# EAGLE design RPi GPS (EAGLE 7.7.0)
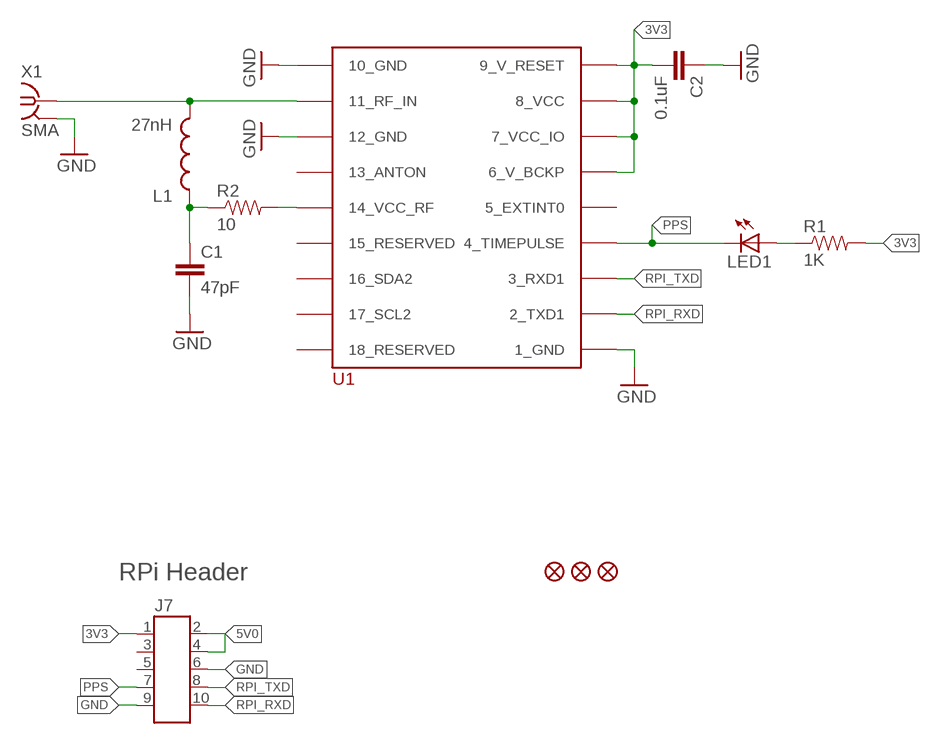
[diagram p0: schematic, sheet 1]

## Parts
C1  47pF  CAP0603-CAP  [0603-CAP]
C2  0.1uF  CAP0603-CAP  [0603-CAP]
FID2  FIDUCIAL  [FIDUCIAL]
FID3  FIDUCIAL  [FIDUCIAL]
FID4  FIDUCIAL  [FIDUCIAL]
J7  HEADER-2X5-0.1  [HEADER-2X5]
L1  27nH  INDUCTOR0603  [0603]
LED1  LED0603  [LED-0603]
R1  1K  RESISTOR0603-RES  [0603-RES]
R2  10  RESISTOR0603-RES  [0603-RES]
U1  UBLOX_MAX  [UBLOX_MAX]
X1  SMA  [SMA_EDGE]

## Nets
3V3: C2.2 J7.1 R1.2 U1.6_V_BCKP U1.7_VCC_IO U1.8_VCC U1.9_V_RESET
5V0: J7.2 J7.4
GND: C1.2 C2.1 J7.6 J7.9 U1.1_GND U1.10_GND U1.12_GND X1.GND@1 X1.GND@2 X1.GND@3 X1.GND@4
N$1: L1.2 U1.11_RF_IN X1.SIG
N$2: LED1.A R1.1
N$3: R2.2 U1.14_VCC_RF
N$4: C1.1 L1.1 R2.1
PPS: J7.7 LED1.C U1.4_TIMEPULSE
RPI_RXD: J7.10 U1.2_TXD1
RPI_TXD: J7.8 U1.3_RXD1
Unconnected: J7.3 J7.5 U1.5_EXTINT0 U1.13_ANTON U1.15_RESERVED U1.16_SDA2 U1.17_SCL2 U1.18_RESERVED

## Notes on the sheet
- RPi Header

## Library data of the parts
C1 C2 = SparkFun:CAP: Capacitor Standard 0603 ceramic capacitor, and 0.1" leaded capacitor.
FID2-FID4 = Nigel:FIDUCIAL
J7 = Nigel:HEADER-2X5
L1 = SparkFun:INDUCTOR: Inductors Basic Inductor/Choke - 0603 and 1206. Footprints are not proven and vary greatly between part numbers.
LED1 = SparkFun:LED: LEDs Standard schematic elements and footprints for 5mm, 3mm, 1206, and 0603 sized LEDs. 5mm - Spark Fun Electronics SKU : COM-00529 (and others)
R1 R2 = SparkFun:RESISTOR: Resistor Basic schematic elements and footprints for 0603, 1206, and PTH resistors.
U1 = Ava:UBLOX_MAX: UBLOX MAX
X1 = Nigel:SMA

## Board
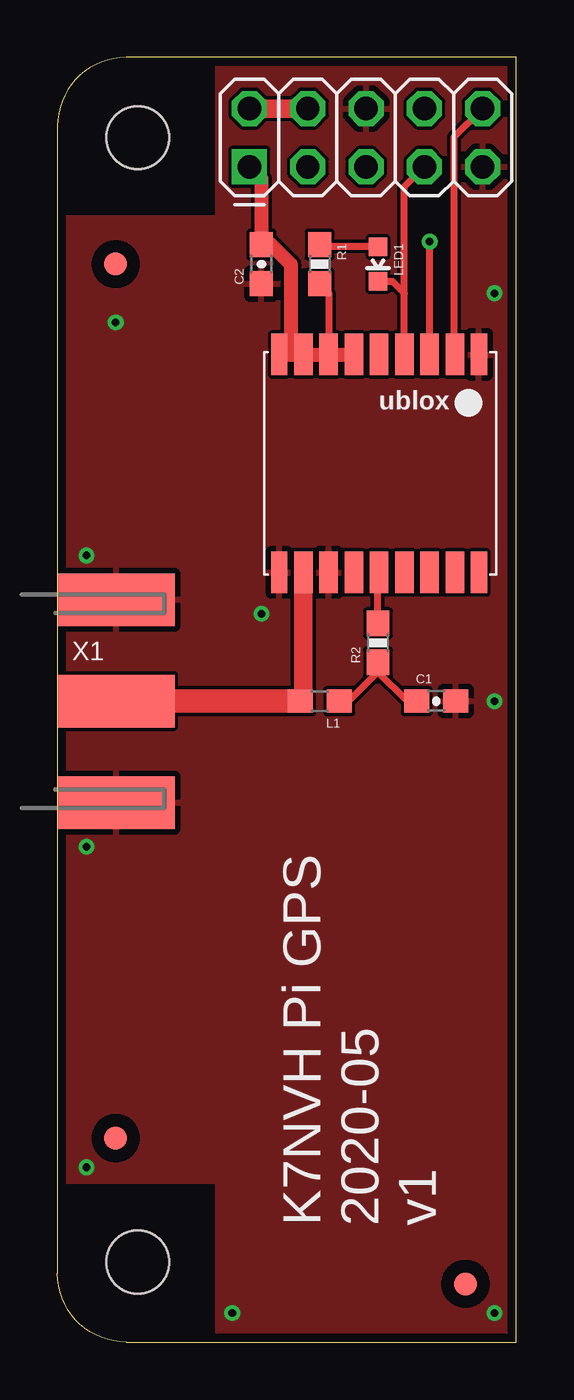
[diagram p1: board, top side]
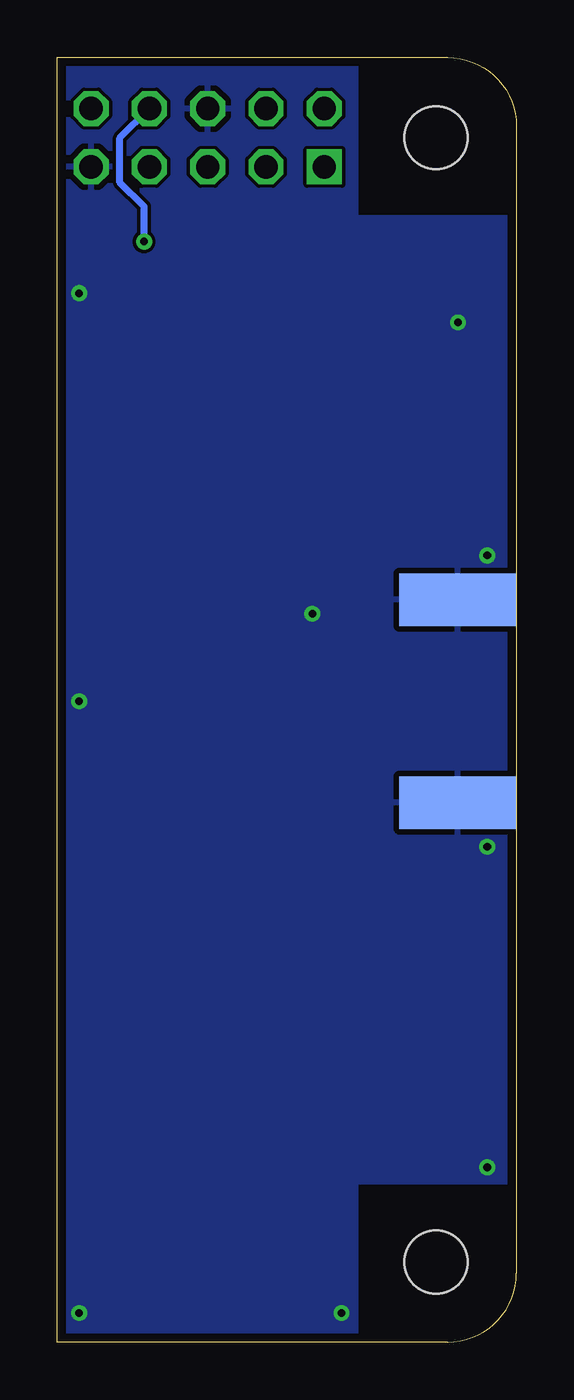
[diagram p2: board, bottom side, seen from below]

Size 20 x 56 mm. Coordinates in mm from the lower left corner, seen from the top.
Outline: 3,0 20,0 20,56 3,56 arc90 0,53 0,3 arc90 3,0
Copper layers (1*16): Top 0.0356mm / dielectric 1.5011mm / Bottom 0.0356mm
Design rules "LaenPCBOrder": minimum track width 6mil, minimum drill 13mil, track to track 6mil, track to pad 6mil, pad to pad 6mil, via to via 6mil, smd to smd 6mil, copper to edge 15mil, drill to drill 6mil, minimum pad ring 7mil, minimum via ring 7mil, stop-mask expansion 3mil, vias tented up to drill 0mil, thermal gap 10mil
Holes 2.75 mm at 3.5,3.5 3.5,52.5
tKeepout: area 0.4,0.4 to 6.6,6.6; area 0.4,49.4 to 6.6,55.6; area 58.4,49.4 to 64.6,55.6; area 58.4,0.4 to 64.6,6.6
bKeepout: area 0.4,0.4 to 6.6,6.6; area 0.4,49.4 to 6.6,55.6; area 58.4,49.4 to 64.6,55.6; area 58.4,0.4 to 64.6,6.6

### Footprints (pad centres in the part's own frame; a part is rotated, then mirrored left to right if it is on the bottom)
0603-CAP = smd 1.1 x 1: 1 -0.85,0; 2 0.85,0
FIDUCIAL = smd 1 x 1: 1 0,0
HEADER-2X5 = drill 1.016 square: 1 -5.08,-1.27 | drill 1.016 octagon: 2 -5.08,1.27; 3 -2.54,-1.27; 4 -2.54,1.27; 5 0,-1.27; 6 0,1.27; 7 2.54,-1.27; 8 2.54,1.27; 9 5.08,-1.27; 10 5.08,1.27
0603 = smd 1.1 x 1: 1 -0.85,0; 2 0.85,0
LED-0603 = smd 0.8 x 0.8: A 0,-0.75; C 0,0.75
0603-RES = smd 1.1 x 1: 1 -0.85,0; 2 0.85,0
UBLOX_MAX = smd 1.8 x 0.7: 1_GND 4.95,-4.4; 9_V_RESET 4.95,4.3; 10_GND -4.55,4.3; 18_RESERVED -4.55,-4.4 | smd 1.8 x 0.8: 2_TXD1 4.95,-3.35; 3_RXD1 4.95,-2.25; 4_TIMEPULSE 4.95,-1.15; 5_EXTINT0 4.95,-0.05; 6_V_BCKP 4.95,1.05; 7_VCC_IO 4.95,2.15; 8_VCC 4.95,3.25; 11_RF_IN -4.55,3.25; 12_GND -4.55,2.15; 13_ANTON -4.55,1.05; 14_VCC_RF -4.55,-0.05; 15_RESERVED -4.55,-1.15; 16_SDA2 -4.55,-2.25; 17_SCL2 -4.55,-3.35
SMA_EDGE = smd 5.08 x 2.286: GND@1 2.565,4.42; GND@2 2.565,-4.42; SIG 2.565,0 | smd 5.08 x 2.286 bottom: GND@3 2.565,4.42; GND@4 2.565,-4.42

### Placement (x,y rotation side)
C1  16.51,27.94 0 top
C2  8.89,46.99 90 top
FID2  2.54,46.99 0 top
FID3  2.54,8.89 0 top
FID4  17.78,2.54 0 top
J7  13.45,52.5 0 top
L1  11.43,27.94 180 top
LED1  13.97,46.99 180 top
R1  11.43,46.99 270 top
R2  13.97,30.48 90 top
U1  13.97,38.1 90 top
X1  0,27.94 0 top

### Tracks (layer width: path | path; a pad name or v marks a point on that pad's centre or on a via)
3V3
  Top 0.305: R1.2 11.82,45.75 U1.7_VCC_IO
  Top 0.61: U1.9_V_RESET 10.16,43.05 | 10.16,43.05 U1.8_VCC U1.7_VCC_IO U1.6_V_BCKP | J7.1 8.89,50.71 C2.2 9.31,47.84 10.16,46.99 10.16,43.05
5V0
  Top 0.813: J7.2 J7.4
GND  (via drill 0.33)
  other vias: 2.54,44.45 1.27,34.29 1.27,21.59 1.27,7.62 7.62,1.27 19.05,1.27 19.05,45.72 8.89,31.75 19.05,27.94
  pour Top: 0,49 7,49 7,56 20,56 20,0 7,0 7,7 0,7
  pour Bottom: 0,49 7,49 7,56 20,56 20,0 7,0 7,7 0,7
N$1
  Top 0.61: 10.72,28.08 L1.2
  Top 0.813: U1.11_RF_IN 10.72,28.08
  Top 1.016: L1.2 X1.SIG
N$2
  Top 0.305: LED1.A 11.53,47.74 R1.1
N$3
  Top 0.305: R2.2 13.97,33.5 U1.14_VCC_RF
N$4
  Top 0.305: L1.1 12.7,27.94 13.97,29.21 | C1.1 15.24,27.94 13.97,29.21 | 13.97,29.21 R2.1
PPS
  Top 0.305: U1.4_TIMEPULSE 15.12,45.72 | 15.12,45.72 15.12,50.36 J7.7 | LED1.C 14.6,46.24 15.12,45.72
RPI_RXD
  Top 0.305: J7.10 17.27,52.51 17.27,43.1 U1.2_TXD1
RPI_TXD  (via drill 0.33)
  Top 0.305: U1.3_RXD1 v16.22,47.97
  Bottom 0.305: J7.8 17.27,52.49 17.27,50.55 16.22,49.49 v16.22,47.97

### Text on the board
tPlace: K7NVH Pi GPS / 2020-05 / v1